# Altium project PCB_Project_2.PrjPcb
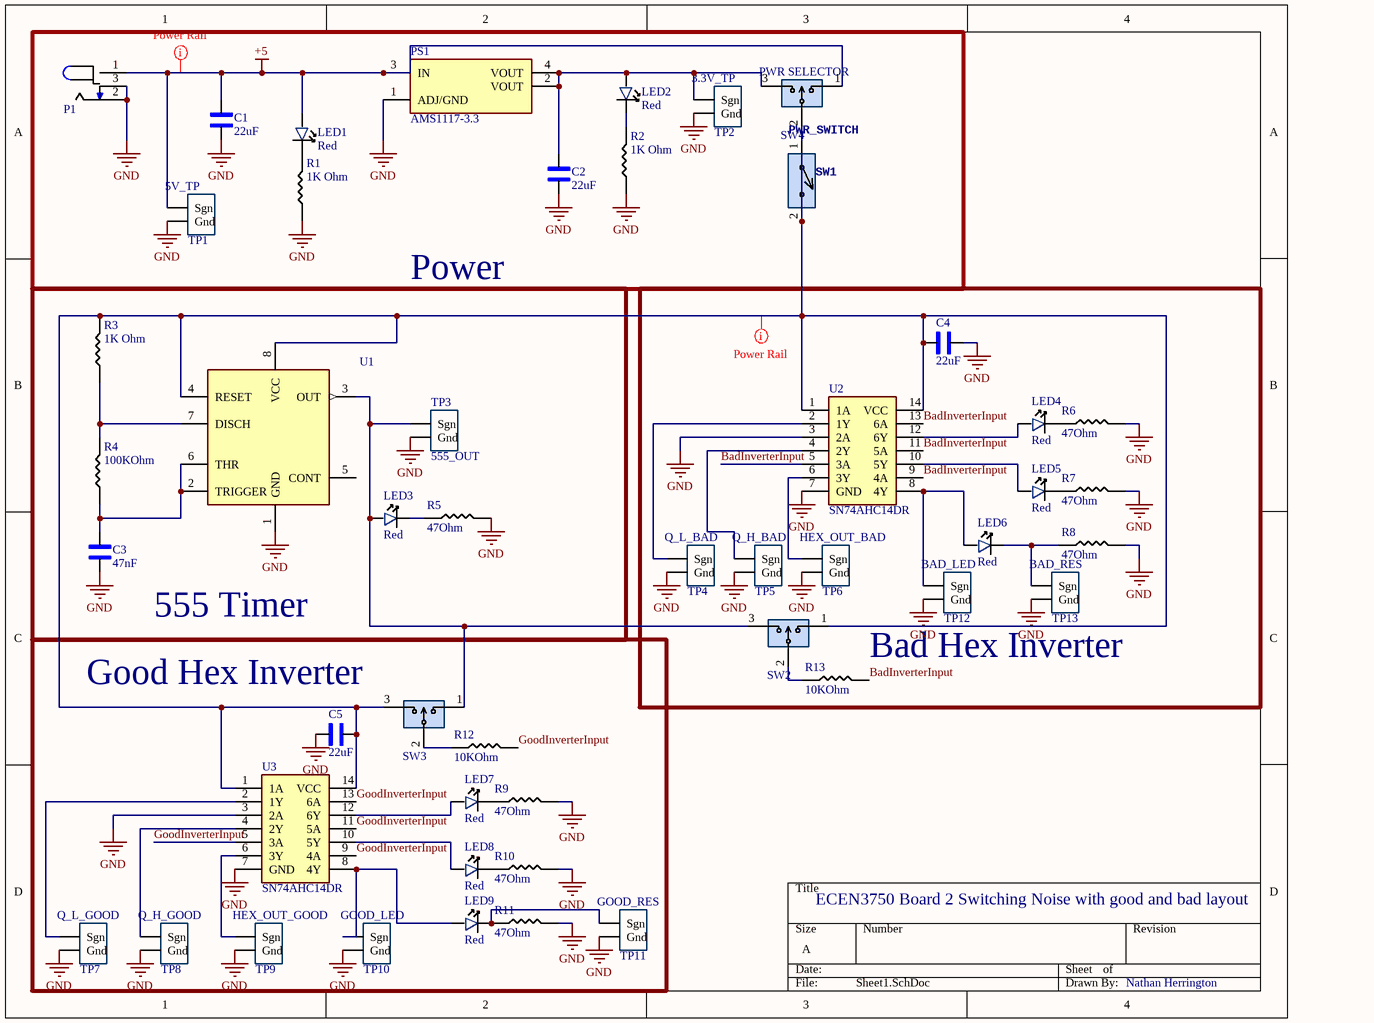
[diagram p0: Sheet1.SchDoc]
1 sheet, 49 parts. Net scope: global (net labels, ports and power ports of the same name join across sheets).
Board file: PCB1.PcbDoc

## Sheet Sheet1.SchDoc
size A; SheetNumber: 1; SheetTotal: 1

### Parts
C1  22uF  [1206_Passive_Capacitor]
C2  22uF  [1206_Passive_Capacitor]
C3  47nF  [1206_Passive_Capacitor]
C4  22uF  [1206_Passive_Capacitor]
C5  22uF  [1206_Passive_Capacitor]
LED1  Red  [LED_1206]
LED2  Red  [LED_1206]
LED3  Red  [LED_1206]
LED4  Red  [LED_1206]
LED5  Red  [LED_1206]
LED6  Red  [LED_1206]
LED7  Red  [LED_1206]
LED8  Red  [LED_1206]
LED9  Red  [LED_1206]
P1  Power Jack  [Power_Jack]  (value not drawn)
PS1  AMS1117-3.3  [LDO]
R1  value 1K Ohm  [1206_Passive_Resitor]  (hidden comment: 1k)
R2  value 1K Ohm  [1206_Passive_Resitor]  (hidden comment: 1k)
R3  value 1K Ohm  [1206_Passive_Resitor]  (hidden comment: 1k)
R4  100KOhm  [1206_Passive_Resitor]
R5  value 47Ohm  [1206_Passive_Resitor]  (hidden comment: 47 Ohms)
R6  value 47Ohm  [1206_Passive_Resitor]  (hidden comment: 47 Ohms)
R7  value 47Ohm  [1206_Passive_Resitor]  (hidden comment: 47 Ohms)
R8  value 47Ohm  [1206_Passive_Resitor]  (hidden comment: 47 Ohms)
R9  value 47Ohm  [1206_Passive_Resitor]  (hidden comment: 47 Ohms)
R10  value 47Ohm  [1206_Passive_Resitor]  (hidden comment: 47 Ohms)
R11  value 47Ohm  [1206_Passive_Resitor]  (hidden comment: 47 Ohms)
R12  value 10KOhm  [1206_Passive_Resitor]  (hidden comment: 10k)
R13  value 10KOhm  [1206_Passive_Resitor]  (hidden comment: 10k)
SW1  PWR_SWITCH  [2Pin-Header-Conn]
SW2  PREC003SAAN-RC  [3_PIN_100mil]  (value not drawn)
SW3  PREC003SAAN-RC  [3_PIN_100mil]  (value not drawn)
SW4  PWR SELECTOR  [3_PIN_100mil]
TP1  5V_TP  [TP10x_Probe]
TP2  3.3V_TP  [TP10x_Probe]
TP3  555_OUT  [TP10x_Probe]
TP4  Q_L_BAD  [TP10x_Probe]
TP5  Q_H_BAD  [TP10x_Probe]
TP6  HEX_OUT_BAD  [TP10x_Probe]
TP7  Q_L_GOOD  [TP10x_Probe]
TP8  Q_H_GOOD  [TP10x_Probe]
TP9  HEX_OUT_GOOD  [TP10x_Probe]
TP10  GOOD_LED  [TP10x_Probe]
TP11  GOOD_RES  [TP10x_Probe]
TP12  BAD_LED  [TP10x_Probe]
TP13  BAD_RES  [TP10x_Probe]
U1  LMC555CMX/NOPB  [TS555IDTTR]  (value not drawn)
U2  SN74AHC14DR  [HEX_74AC14]
U3  SN74AHC14DR  [HEX_74AC14]

### Blocks framed on the sheet
Power: C1 C2 LED1 LED2 P1 PS1 R1 R2 SW1 SW4 TP1 TP2
Bad Hex Inverter: C4 LED4-LED6 R6-R8 R13 SW2 TP4-TP6 TP12 TP13 U2

### Nets
+5: C1.2 LED1.1 P1.1 PS1.3(IN) SW4.1 TP1.1(Sgn)
GND: C1.1 C2.1 C3.1 C4.2 C5.1 P1.2 P1.3 PS1.1(ADJ/GND) R1.1 R2.1 R5.2 R6.2 R7.2 R8.2 R9.2 R10.2 R11.2 TP1.2(Gnd) TP2.2(Gnd) TP3.2(Gnd) TP4.2(Gnd) TP5.2(Gnd) TP6.2(Gnd) TP7.2(Gnd) TP8.2(Gnd) TP9.2(Gnd) TP10.2(Gnd) TP11.2(Gnd) TP12.2(Gnd) TP13.2(Gnd) U1.1(GND) U2.3(2A) U2.7(GND) U3.3(2A) U3.7(GND)
BadInverterInput: R13.2 U2.5(3A) U2.9(4A) U2.11(5A) U2.13(6A)
GoodInverterInput: R12.2 U3.5(3A) U3.9(4A) U3.11(5A) U3.13(6A)
NetC2_2: C2.2 LED2.1 PS1.2(VOUT) PS1.4(VOUT) SW4.3 TP2.1(Sgn)
NetC3_2: C3.2 R4.1 U1.2(TRIGGER) U1.6(THR)
NetC4_1: C4.1 C5.2 R3.2 SW1.2 SW2.1 SW3.3 U1.4(RESET) U1.8(VCC) U2.1(1A) U2.14(VCC) U3.1(1A) U3.14(VCC)
NetLED1_2: LED1.2 R1.2
NetLED2_2: LED2.2 R2.2
NetLED3_1: LED3.1 SW2.3 SW3.1 TP3.1(Sgn) U1.3(OUT)
NetLED3_2: LED3.2 R5.1
NetLED4_1: LED4.1 U2.12(6Y)
NetLED4_2: LED4.2 R6.1
NetLED5_1: LED5.1 U2.10(5Y)
NetLED5_2: LED5.2 R7.1
NetLED6_1: LED6.1 TP12.1(Sgn) U2.8(4Y)
NetLED6_2: LED6.2 R8.1 TP13.1(Sgn)
NetLED7_1: LED7.1 U3.12(6Y)
NetLED7_2: LED7.2 R9.1
NetLED8_1: LED8.1 U3.10(5Y)
NetLED8_2: LED8.2 R10.1
NetLED9_1: LED9.1 TP10.1(Sgn) U3.8(4Y)
NetLED9_2: LED9.2 R11.1 TP11.1(Sgn)
NetR3_1: R3.1 R4.2 U1.7(DISCH)
NetR12_1: R12.1 SW3.2
NetR13_1: R13.1 SW2.2
NetSW1_1: SW1.1 SW4.2
NetTP4_1: TP4.1(Sgn) U2.2(1Y)
NetTP5_1: TP5.1(Sgn) U2.4(2Y)
NetTP6_1: TP6.1(Sgn) U2.6(3Y)
NetTP7_1: TP7.1(Sgn) U3.2(1Y)
NetTP8_1: TP8.1(Sgn) U3.4(2Y)
NetTP9_1: TP9.1(Sgn) U3.6(3Y)

Not connected (* = marked no-connect by the designer): U1 5(CONT)

### Layout directives
rule Width Constraint [Pref Width = 20mil    Min Width = 10mil    Max Width = 100mil]: +5, NetC4_1

### Notes on the sheet
- 555 Timer
- (near SW3) Good Hex Inverter
- ECEN3750 Board 2 Switching Noise with good and bad layout
- Nathan Herrington

### Library data of the parts
C1 C2 C4 C5 = C_22uF_1206: 22uF ±10% 25V X5R 1206 Multilayer Ceramic Capacitors MLCC - SMD/SMT RoHS; MFR Part #: CL31A226KAHNNNE; Type: basic; LCSC Part#: C12891; Datasheet: https://datasheet.lcsc.com/lcsc/1811031514_Samsung-Electro-Mechanics-CL31A226KAHNNNE_C12891.pdf; Value: 22uF
C3 = C_47nF_1206: 47nF ±5% 50V C0G 1206 Multilayer Ceramic Capacitors MLCC - SMD/SMT RoHS; MFR Part #: GRM31M5C1H473JA01L; Type: Extended; LCSC Part#: C21812; Datasheet: https://datasheet.lcsc.com/lcsc/1810201313_Murata-Electronics-GRM31M5C1H473JA01L_C21812.pdf; Value: 47nF
LED1-LED9 = LED_RED_1206: Red 621~631nm 1206 Light Emitting Diodes (LED) RoHS; MFR Part #: 15-21/R6C-FQ1R1B/2T; Type: Extended; LCSC Part#: C93133; Datasheet: https://datasheet.lcsc.com/szlcsc/1811151241_Everlight-Elec-15-21-R6C-FQ1R1B-2T_C93133.pdf; Value: Red
P1 = P_Power Jack: Power Barrel Connector Jack 2.10mm ID (0.083"), 5.50mm OD (0.217") Through Hole, Right Angle; MFR Part #: PJ-102A; Value: CONN PWR JACK 2X5.5MM SOLDER; Digikey Link: https://www.digikey.com/product-detail/en/PJ-102A/CP-102A-ND/275425/?itemSeq=304982367; LCSC Part#: C136744; Type: Extended
PS1 = PS_AMS_LDO_3v3: LOW DROPOUT REGULATORS(LDO) POSITIVE FIXED 1.3V @ 800MA 15V 3.3V 1A SOT-223 ROHS; Value: IC REG LINEAR 3.3V 800MA SOT223; MFR Part #: AMS1117-3.3; LCSC Part#: C6186; Type: Basic
R1-R3 = R_1K_1206: CHIP RESISTOR - SURFACE MOUNT 1KOHMS ±1% 1/4W 1206 ROHS; MFR Part #: RNCP1206FTD1K00CT; Digikey Link: https://www.digikey.com/product-detail/en/RNCP1206FTD1K00/RNCP1206FTD1K00CT-ND/2240675/?itemSeq=304982373; LCSC Part#: C4410; Type: Basic
R4 = R_100KOhm_1206: 100kΩ ±1% 0.25W ±100ppm/℃ 1206 Chip Resistor - Surface Mount RoHS; MFR Part #: 1206W4F1003T5E; LCSC Part#: C17900; Datasheet: https://datasheet.lcsc.com/lcsc/1810301421_UNI-ROYAL-Uniroyal-Elec-1206W4F1003T5E_C17900.pdf; Type: Basic; Value: 100KOhm
R5-R11 = R_47Ohm_1206: 47Ω ±5% 0.25W ±200ppm/℃ 1206 Chip Resistor - Surface Mount RoHS; MFR Part #: 1206W4J0470T5E; LCSC Part#: C25384; Type: Extended; Datasheet: https://datasheet.lcsc.com/lcsc/1811101020_UNI-ROYAL-Uniroyal-Elec-1206W4J0470T5E_C25384.pdf
R12 R13 = R_10KOhm_1206: 10 kOhms ±5% 0.25W, 1/4W Chip Resistor 1206 (3216 Metric) Automotive AEC-Q200 Thick Film; MFR Part #: RMCF1206FT10K0; Digikey Link: https://www.digikey.com/en/products/detail/stackpole-electronics-inc/RMCF1206FT10K0/1759669; LCSC Part#: C17902; Type: Basic
SW1 = SW_2Pin_100mil_Switch: 2Pin Header; LCSC Part#: C124375; Type: Extended
SW2 SW3 = SW_3Pin_100mil_Switch: Connector Header Through Hole 3 position 0.100" (2.54mm); Value: CONN HEADER VERT 3POS 2.54MM; Digikey Link: https://www.digikey.com/product-detail/en/PREC003SAAN-RC/S1012EC-03-ND/2774851/?itemSeq=304982371; MFR Part #: PREC003SAAN-RC; Type: Extended; LCSC Part#: C49257
SW4 = SW_3Pin_100mil_Switch: Connector Header Through Hole 3 position 0.100" (2.54mm); MFR Part #: PREC003SAAN-RC; Value: CONN HEADER VERT 3POS 2.54MM; Digikey Link: https://www.digikey.com/product-detail/en/PREC003SAAN-RC/S1012EC-03-ND/2774851/?itemSeq=304982371; Type: Extended; LCSC Part#: C49257
TP1-TP13 = TP_10x_Probe: Test Point 300 mil centers
U1 = U_555_Fast: 555 Type, Timer/Oscillator _Single_ IC 3MHz 8-SO; Package: SOIC-8; MFR Part #: LMC555CMX/NOPB; DigiKey link: https://www.digikey.com/product-detail/en/texas-instruments/LMC555CMX-NOPB/LMC555CMX-NOPBCT-ND/1010550; LCSC Part#: C90760; Type: Extended
U2 U3 = U_74AHC14: Inverter IC 6 Channel Schmitt Trigger 14-SOIC; Datasheet: https://datasheet.lcsc.com/szlcsc/ON-Semicon-ON-74AC14SCX_C5482.pdf; MFR Part #: SN74AHC14DR; LCSC Part#: C6942; Type: Extended